# EasyEDA Pro project FSS1500-HANDoldd.eprj

# Schematic Schematic1
Create Date: 2022-12-30; Page Name: P1; Project Name: FSS1500-HAND; Schematic Name: Schematic1; Update Date: 2023-02-14
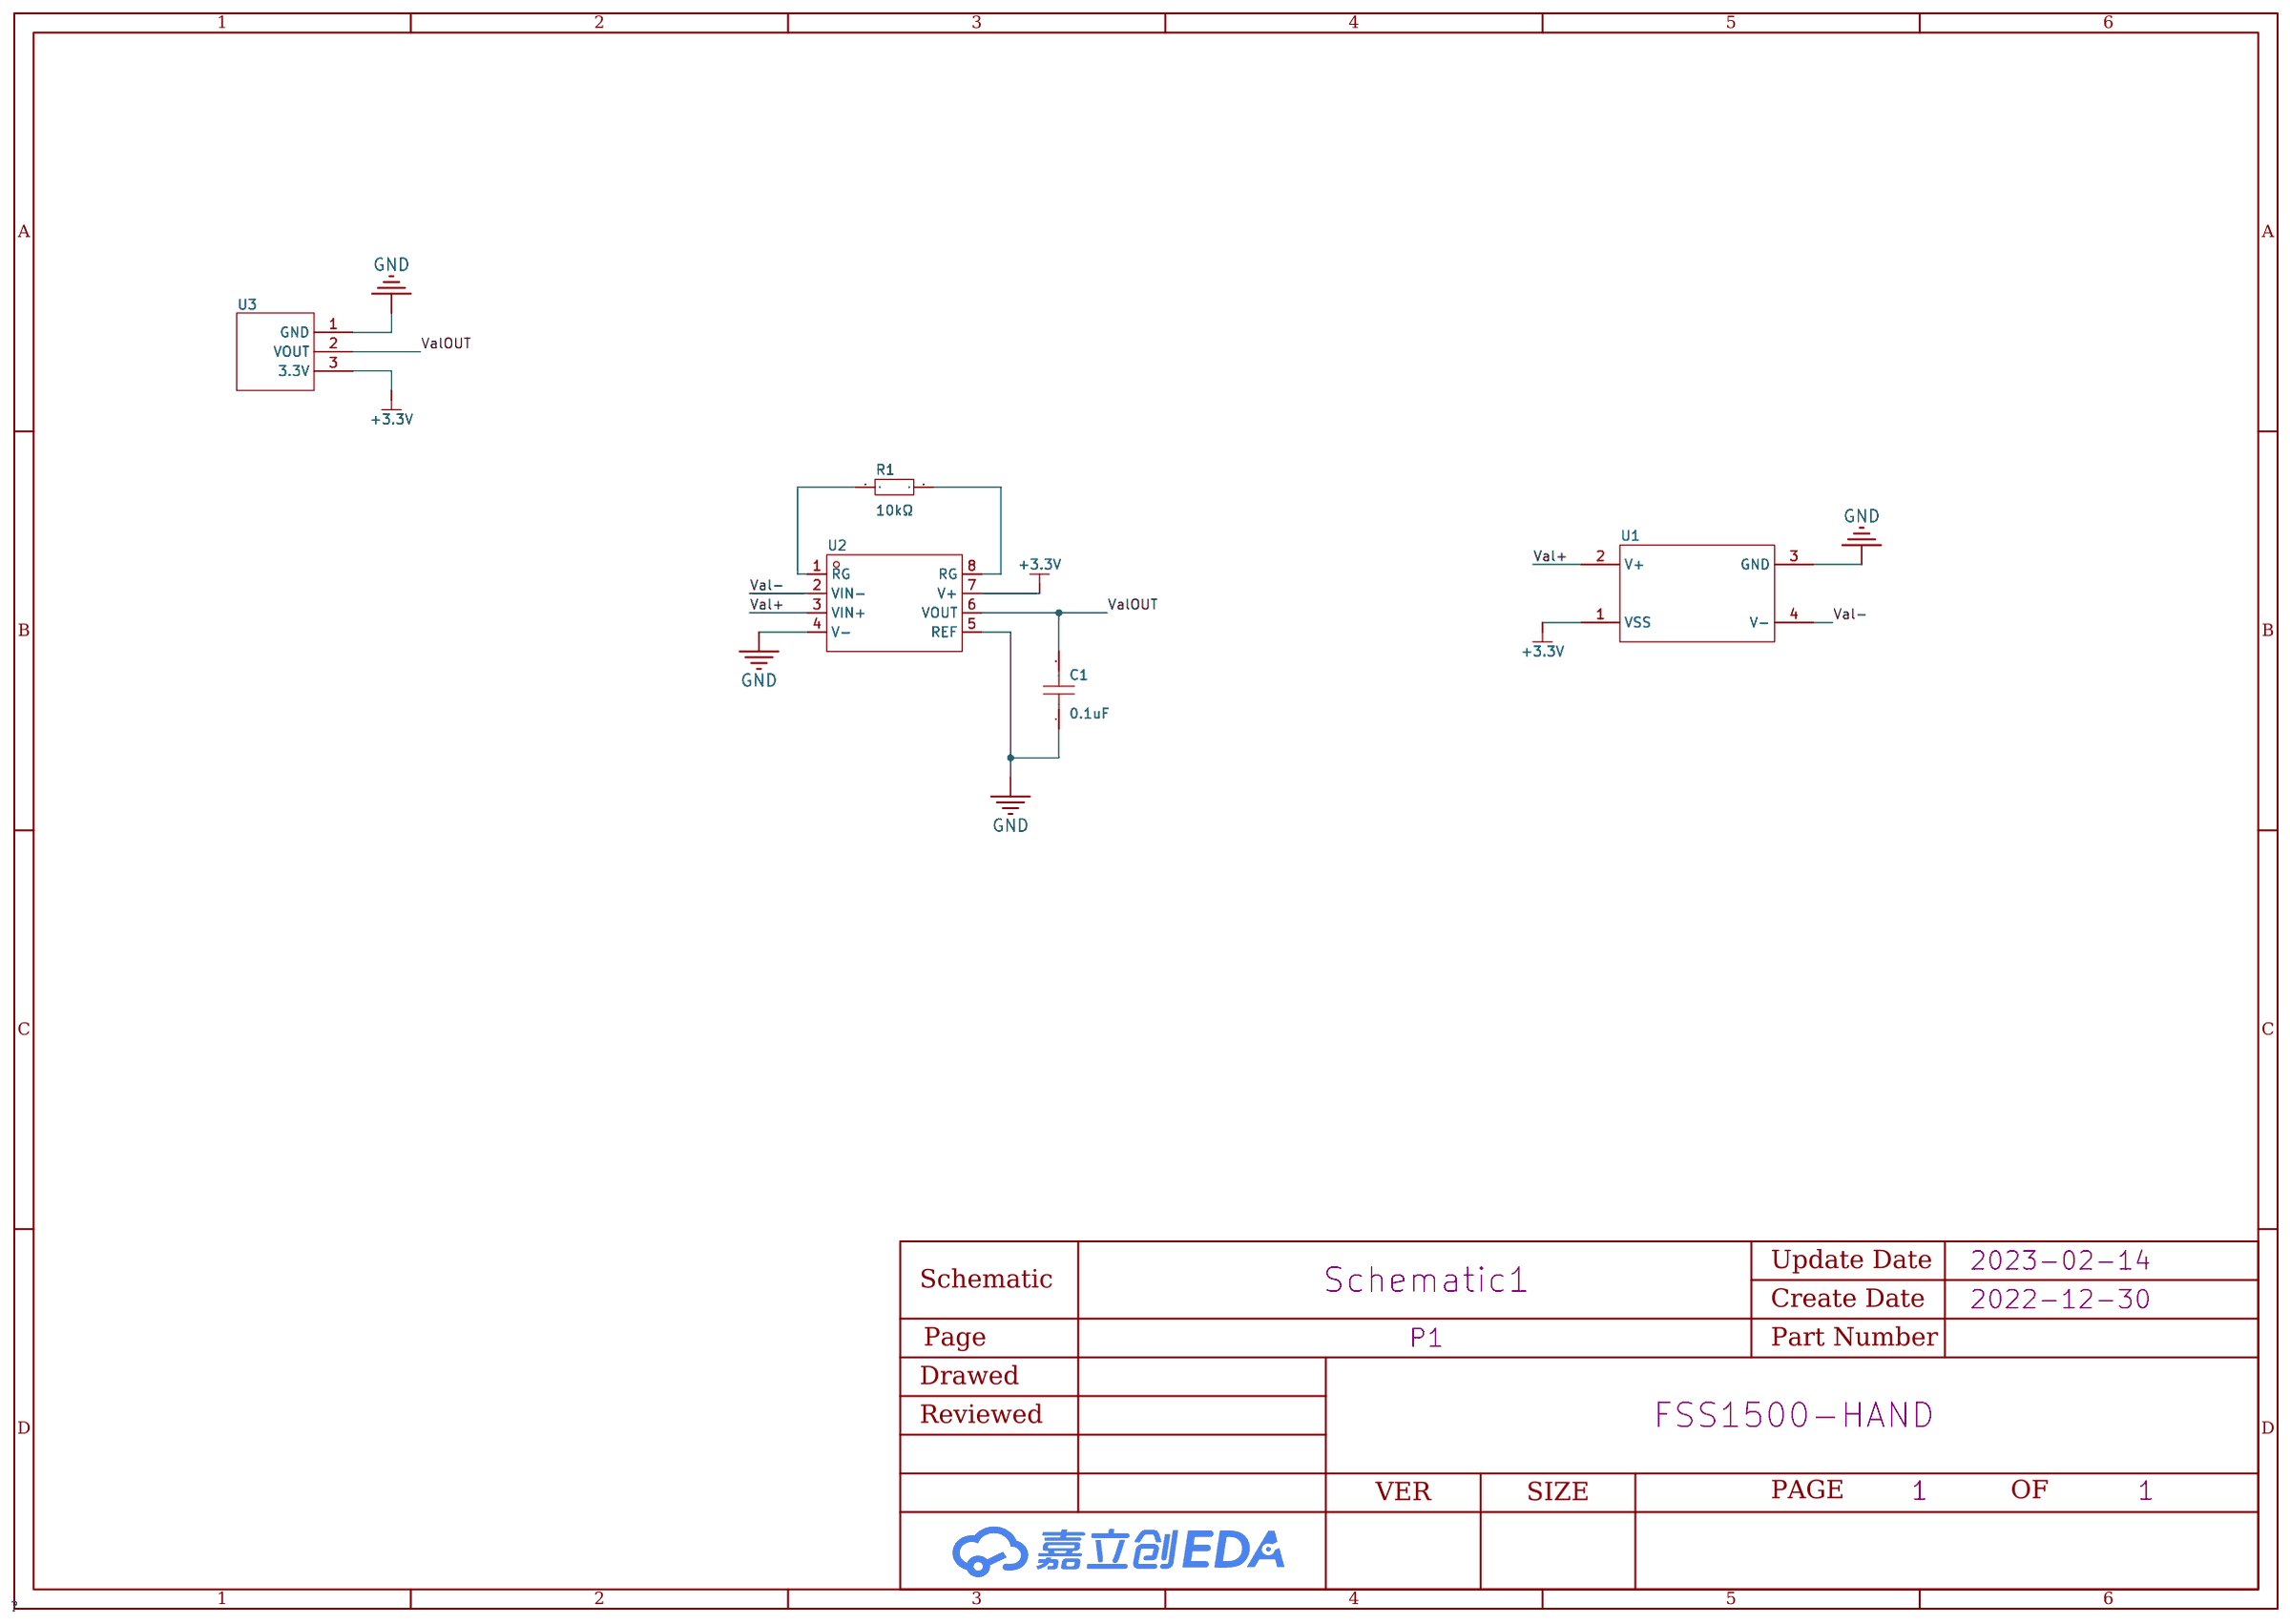
[diagram p0: schematic sheet]

## Parts
C1  0.1uF  [C0603]
R1  10kΩ  [R0603]
U1  -  [FSS1500]
U2  INA333AIDGKR  [MSOP-8_L3.0-W3.0-P0.65-LS5.0-BL]
U3  -  [3POINT]

## Library data of the parts
C1 = 0603B103K160CT: 容值:10nF;精度:±10%;额定电压:16V;温度系数:X7R;; LCSC Part Name: 10nF ±10% 16V; Supplier Part: C163173; Manufacturer: 华新科(Walsin); Supplier Footprint: 0603; JLCPCB Part Class: Extended Part; Datasheet: https://atta.szlcsc.com/upload/public/pdf/source/20181012/C163173_1585359A967D21AC01CFCC54F2F93144.pdf; Supplier: LCSC; Tolerance: ±10%; Voltage Rated: 16V; Temperature Coefficient: X7R
R1 = CR0603JA0103G: 电阻类型:厚膜电阻;阻值:10kΩ;精度:±5%;功率:1/10W;温度系数:±200ppm/;最大工作电压:50V;工作温度范围:-55~+125;; LCSC Part Name: 10kΩ ±5%; Supplier Part: C101254; Manufacturer: LIZ(丽智电子); Supplier Footprint: 0603; JLCPCB Part Class: Extended Part; Datasheet: https://atta.szlcsc.com/upload/public/pdf/source/20170408/1491631441449.pdf; Supplier: LCSC; Type: 厚膜电阻; Tolerance: ±5%; Power(Watts): 1/10W; Temperature Coefficient: ±200ppm/; Overload Voltage (Max): 50V; Operating Temperature Range: -55~+125
U1 = FSS1500
U2 = INA333AIDGKR: 运放类型:Instrumentation;放大器组数:1;增益带宽积（GBP）:-;压摆率（SR）:0.16 V/us;电源电压:1.8V ~ 5.5V, ±0.9V ~ 2.75V;各通道供电电流:75uA;; Supplier Part: C19450; Manufacturer: TI(德州仪器); Supplier Footprint: VSSOP-8; JLCPCB Part Class: Extended Part; Datasheet: https://atta.szlcsc.com/upload/public/pdf/source/20130925/1457706651096.pdf; Supplier: LCSC; Amplifier Type: Instrumentation; Number of Circuits: 1; Slew Rate（SR）: 0.16 V/us; Output Type: Rail-to-Rail; Supply Voltage（Single）: 1.8V ~ 5.5V, ±0.9V ~ 2.75V; Iq per channel (Typ): 75uA; Operating Temperature: -40°C ~ 125°C
U3 = 3POINT

## Nets
+3.3V: U1.1(VSS) U2.7(V+) U3.3(3.3V)
GND: C1.1 U1.3(GND) U2.4(V-) U2.5(REF) U3.1(GND)
Val+: U1.2(V+) U2.3(VIN+)
Val-: U1.4(V-) U2.2(VIN-)
ValOUT: C1.2 U2.6(VOUT) U3.2(VOUT)
$1N427: R1.1 U2.1(RG)
$1N434: R1.2 U2.8(RG)

# Board PCB1
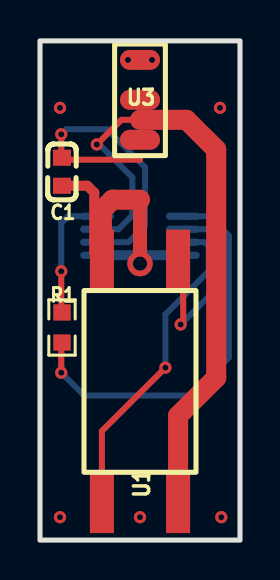
[diagram p1: board, top side]
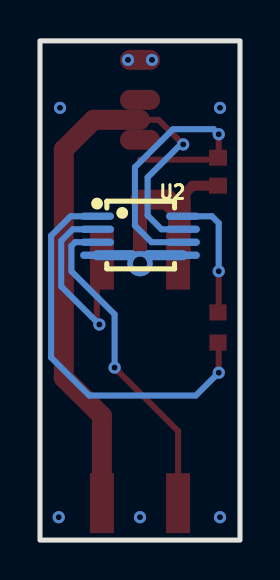
[diagram p2: board, bottom side, seen from below]

Outline 10 x 25 mm; copper layers: Top Layer, Bottom Layer. Coordinates in mm from the lower left corner of the outline.
Outline path: rectangle 0,25 10,0
Stack: Top Layer 0.035mm / Dielectric1 1.51mm FR4 er 4.5 / Bottom Layer 0.035mm

## Design rules (mm)
spacing safeClearance (default): track to track 0.152, other pairs 0.152 to 0.3
track width trackWidth (default): min 0.127, default 0.254, max 2.54
differential pair differentialPair (default): width min 0.127, default 0.254, max 2.54; gap min 0.152, default 0.152
via viaSize (default): diameter min 0.5, default 0.61, max 10; hole min 0.3, default 0.305, max 6

## Placement (name value [footprint] x y rotation side)
C1  0.1uF  [C0603]  1.1 18.44 90 top
R1  10kΩ  [R0603]  1.1 10.64 90 top
U1  -  [FSS1500]  5 7.94 90 top
U2  INA333AIDGKR  [MSOP-8_L3.0-W3.0-P0.65-LS5.0-BL]  5 15.24 270 bottom
U3  -  [3POINT]  5 19.05 90 top

## Footprints (pads in the part's own frame, mm; a bottom-side part is the same pattern mirrored in y, then rotated)
3POINT
  oval 1x2 smd: 1(1,0) 2(3,0) 3(5,0)
C0603
  rect 0.8x0.899 smd: 1(-0.701,0) 2(0.701,0)
FSS1500
  rect 3x1.2 smd: 1(-6.096,-1.905) 2(-6.096,1.905) 3(6.096,1.905) 4(6.096,-1.905)
MSOP-8_L3.0-W3.0-P0.65-LS5.0-BL
  oval 0.363x1.692 smd: 1(-0.976,-2.147) 2(-0.325,-2.147) 3(0.325,-2.147) 4(0.976,-2.147) 5(0.976,2.147) 6(0.325,2.147) 7(-0.325,2.147) 8(-0.976,2.147)
R0603
  rect 0.807x0.864 smd: 1(-0.754,0) 2(0.754,0)

## Nets
+3.3V: U1.1 U2.7 U3.3
GND: C1.1 U1.3 U2.4 U2.5 U3.1
VAL+: U1.2 U2.3
VAL-: U1.4 U2.2
VALOUT: C1.2 U2.6 U3.2
$1N427: R1.1 U2.1
$1N434: R1.2 U2.8

## Via types
v1: diameter 0.61, hole 0.305, Top Layer to Bottom Layer, 13 vias
v2: diameter 1.27, hole 0.711, Top Layer to Bottom Layer, 1 via

## Routing (per net, layer and track width the routed paths; a pad name or vN(x,y) marks a point on that pad's centre or on a via; arc(x,y) is an arc through that point)
+3.3V: length 32
  Top Layer w0.3: 5,21.05 4.07,21.05 v1(2.84,19.81)
  Top Layer w1: U1.1 6.91,6.22 8.81,8.13 8.81,19.56 7.32,21.05 5,21.05
  Bottom Layer w0.3: U2.7 3.93,15.56 4.62,16.26 4.62,18.16 2.97,19.81 v1(2.84,19.81)
GND: length 17.7
  Top Layer w0.5: C1.1 2.37,17.74 2.71,17.4 2.71,14.42 U1.3 ; v2(5,13.84) 5,13.97
  Top Layer w0.7: 5,17.05 5,13.97
  Top Layer w1: 5,17.05 3.63,17.05 3.09,16.51 U1.3
  Bottom Layer w0.5: U2.5 4.58,14.26 v2(5,13.84) 5.42,14.26 U2.4
  vias: v1(1,21.64) v1(1,1.14) v1(4.4,24.05) v1(5,1.14) v1(5.6,24.05) v1(9,21.64) v1(9.06,1.14)
VAL+: length 16.5
  Top Layer w0.3: v1(6.27,8.64) 3.09,5.46 U1.2
  Bottom Layer w0.3: v1(6.27,8.64) 6.27,11.3 8.43,13.46 8.43,14.73 8.25,14.91 U2.3
VAL-: length 10.4
  Top Layer w0.3: v1(7.03,10.8) 7.16,10.92 7.16,13.79 U1.4
  Bottom Layer w0.3: U2.2 8.36,15.56 8.94,14.99 8.94,12.7 v1(7.03,10.8)
VALOUT: length 15.8
  Top Layer w0.3: C1.2 1.2,19.05 5,19.05 5,19.05 ; v1(1.06,20.32) 1.06,19.18
  Bottom Layer w0.3: U2.6 4.42,14.91 5.25,15.75 5.25,18.67 3.35,20.57 1.32,20.57 v1(1.06,20.32)
$1N427: length 20
  Top Layer w0.3: v1(1.06,8.38) 1.06,9.85 R1.1
  Bottom Layer w0.3: v1(1.06,8.38) 2.21,7.24 7.54,7.24 9.44,9.14 9.44,15.24 8.47,16.22 U2.1
$1N434: length 6.4
  Top Layer w0.3: R1.2 1.06,11.44 v1(1.06,13.46)
  Bottom Layer w0.3: U2.8 1.4,16.22 1.06,15.88 v1(1.06,13.46)

## Copper pours and planes (outline as drawn; the poured copper is in the pictures)
GND on Top Layer: 0,25 10,25 10,0 0,0
GND on Bottom Layer: 0,25 10,25 10,0 0,0
